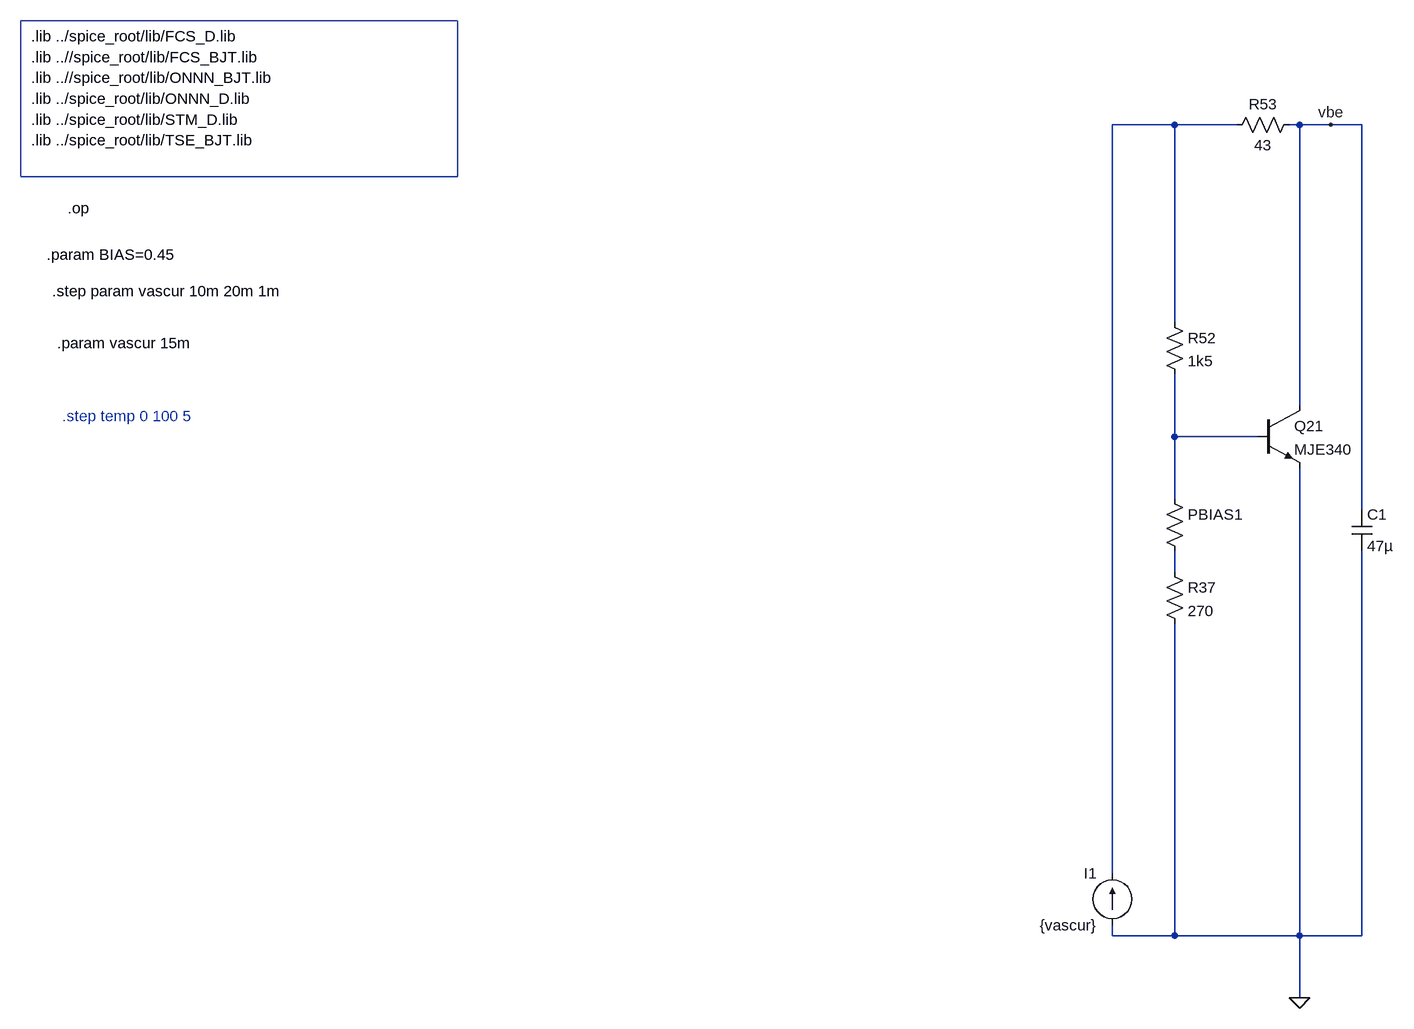
[diagram p0: schematic pab3bbb-compact-vbe-multi.asc]
pab3bbb-compact-vbe-multi.asc, the LTspice schematic file:
Version 4
SHEET 1 6124 2336
WIRE 384 -896 288 -896
WIRE 480 -896 384 -896
WIRE 576 -896 560 -896
WIRE 624 -896 576 -896
WIRE 672 -896 624 -896
WIRE 384 -592 384 -896
WIRE 576 -464 576 -896
WIRE 384 -416 384 -512
WIRE 512 -416 384 -416
WIRE 384 -320 384 -416
WIRE 672 -304 672 -896
WIRE 384 -208 384 -240
WIRE 288 256 288 -896
WIRE 288 352 288 336
WIRE 384 352 384 -128
WIRE 384 352 288 352
WIRE 576 352 576 -368
WIRE 576 352 384 352
WIRE 672 352 672 -240
WIRE 672 352 576 352
WIRE 576 448 576 352
FLAG 576 448 0
FLAG 624 -896 vbe
SYMBOL res 368 -336 R0
WINDOW 3 36 76 Invisible 2
SYMATTR Value {1+(500*BIAS)}
SYMATTR InstName PBIAS1
SYMBOL res 368 -608 R0
SYMATTR InstName R52
SYMATTR Value 1k5
SYMBOL res 576 -912 R90
WINDOW 0 0 56 VBottom 2
WINDOW 3 32 56 VTop 2
SYMATTR InstName R53
SYMATTR Value 43
SYMBOL npn 512 -464 R0
SYMATTR InstName Q21
SYMATTR Value MJE340
SYMBOL res 368 -224 R0
SYMATTR InstName R37
SYMATTR Value 270
SYMBOL cap 656 -240 M180
WINDOW 0 24 56 Left 2
WINDOW 3 24 8 Left 2
SYMATTR InstName C1
SYMATTR Value 47µ
SYMATTR SpiceLine V=25 Irms=1.76 Rser=0.057522 Lser=3n Rpar=4.4meg Cpar=1p
SYMBOL current 288 336 R180
WINDOW 0 24 80 Left 2
WINDOW 3 24 0 Left 2
WINDOW 123 0 0 Left 0
WINDOW 39 0 0 Left 0
SYMATTR InstName I1
SYMATTR Value {vascur}
TEXT -1376 -968 Left 2 !.lib ..//spice_root/lib/ONNN_BJT.lib
TEXT -1376 -904 Left 2 !.lib ../spice_root/lib/STM_D.lib
TEXT -1376 -1000 Left 2 !.lib ..//spice_root/lib/FCS_BJT.lib
TEXT -1376 -1032 Left 2 !.lib ../spice_root/lib/FCS_D.lib
TEXT -1376 -936 Left 2 !.lib ../spice_root/lib/ONNN_D.lib
TEXT -1376 -872 Left 2 !.lib ../spice_root/lib/TSE_BJT.lib
TEXT -1352 -696 Left 2 !.param BIAS=0.45
TEXT -1344 -640 Left 2 !.step param vascur 10m 20m 1m
TEXT -1320 -768 Left 2 !.op
TEXT -1336 -560 Left 2 !.param vascur 15m
TEXT -1328 -448 Left 2 ;.step temp 0 100 5
RECTANGLE Normal -720 -816 -1392 -1056

The netlist it stands for:
* pab3bbb-compact-vbe-multi.asc
R§PBIAS1 N002 N003 {1+(500*BIAS)}
R52 N001 N002 1k5
R53 vbe N001 43
Q21 vbe N002 0 0 MJE340
R37 N003 0 270
C1 0 vbe 47µ V=25 Irms=1.76 Rser=0.057522 Lser=3n Rpar=4.4meg Cpar=1p
I1 0 N001 {vascur}
.model NPN NPN
.model PNP PNP
.lib standard.bjt
.lib ..//spice_root/lib/ONNN_BJT.lib
.lib ../spice_root/lib/STM_D.lib
.lib ..//spice_root/lib/FCS_BJT.lib
.lib ../spice_root/lib/FCS_D.lib
.lib ../spice_root/lib/ONNN_D.lib
.lib ../spice_root/lib/TSE_BJT.lib
.param BIAS=0.45
.step param vascur 10m 20m 1m
.op
.param vascur 15m
* .step temp 0 100 5
.backanno
.end